# Altium schematic sheet TLC6C598_Q1.SchDoc
size 431 x 279 mm; Date: Not shown in title block; ApprovedBy: Not shown in title block; CheckedBy: Not shown in title block; Author: Not shown in title block; CompanyName: Not shown in title block; DrawnBy: Andy Lin (TI); Engineer: Not shown in title block; Organization: Not shown in title block; Address1: Not shown in title block; Address2: Not shown in title block; Address3: Not shown in title block; Address4: Not shown in title block; DocumentNumber: 11; Revision: Use project parameter SCH_Rev; SheetNumber: 11; SheetTotal: 14; PageSetup: Record=PageOptions|CenterHorizontal=True|CenterVertical=True|PrintScale=1.00|XCorrection=1.00|YCorrection=1.00|PrintKind=0|BorderSize=5000000|LeftOffset=0|BottomOffset=0|Orientation=2|PaperLength=1000|PaperWidth=1000|Scale=100|PaperSource=15|PrintQuality=600|MediaType=1|DitherType=10|PaperKind=Letter|PrintScaleMode=1; CurrentTime: Not shown in title block; CurrentDate: Not shown in title block; Time: Not shown in title block; DocumentFullPathAndName: Not shown in title block; DocumentName: Not shown in title block; ModifiedDate: Not shown in title block; ImagePath: Not shown in title block
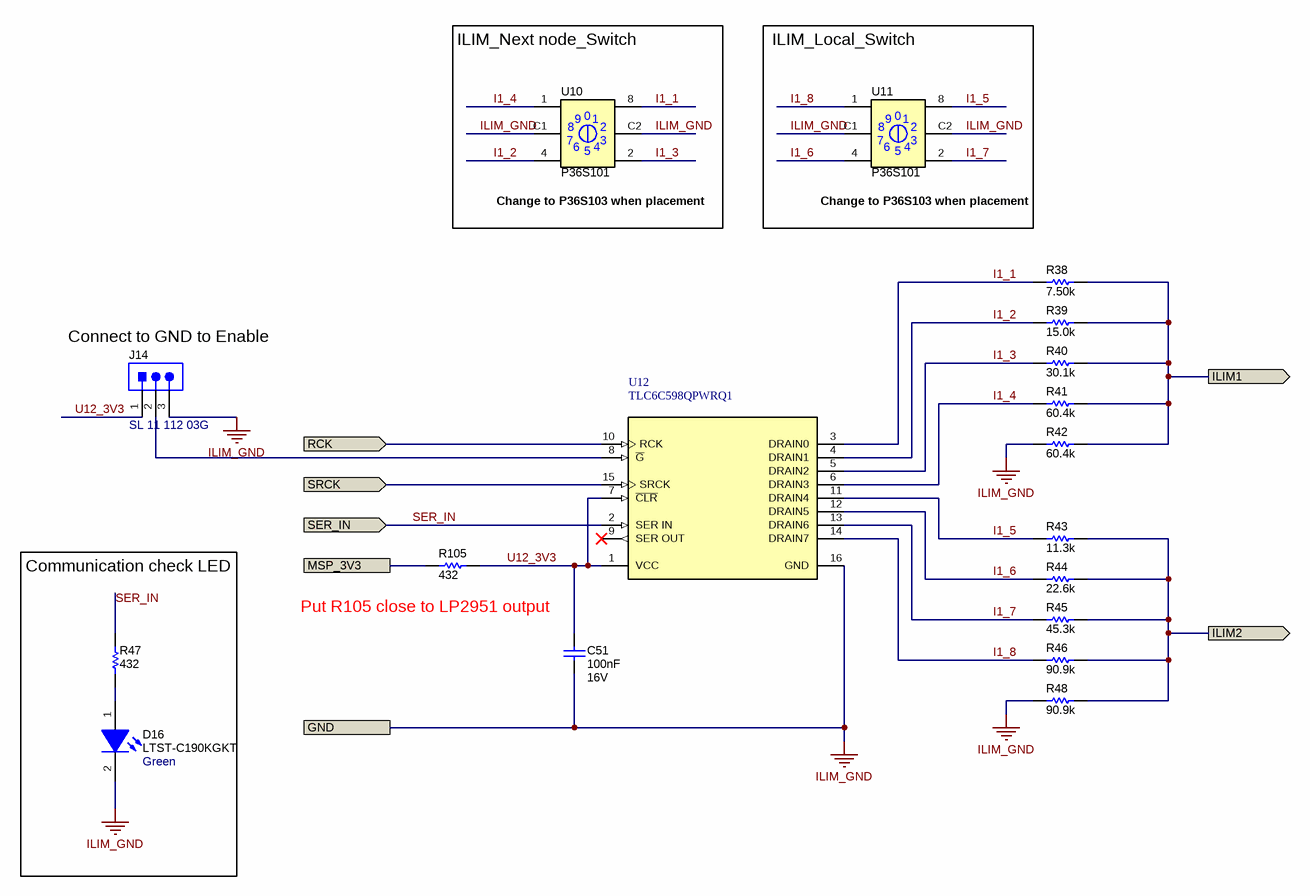
[diagram p0: TLC6C598_Q1.SchDoc]

## Parts
C51  Cap_F: 100nF  VDC_V: 16V  [0603]  (hidden comment: GRM188R71C104KA01D)
D16  LTST-C190KGKT  value Green  [LED_LTST-C190_G]
J14  SL 11 112 03G  [Fischer_SL-11-112-03G]
R38  ValueDisplayed: 7.50k  [0402]  (hidden comment: CRCW04027K50FKED)
R39  ValueDisplayed: 15.0k  [0402]  (hidden comment: CRCW040215K0FKED)
R40  ValueDisplayed: 30.1k  [0402]  (hidden comment: CRCW040230K1FKED)
R41  ValueDisplayed: 60.4k  [0402]  (hidden comment: CRCW040260K4FKED)
R42  ValueDisplayed: 60.4k  [0402]  (hidden comment: CRCW040260K4FKED)
R43  ValueDisplayed: 11.3k  [0402]  (hidden comment: CRCW040211K3FKED)
R44  ValueDisplayed: 22.6k  [0402]  (hidden comment: CRCW040222K6FKED)
R45  ValueDisplayed: 45.3k  [0402]  (hidden comment: CRCW040245K3FKED)
R46  ValueDisplayed: 90.9k  [0402]  (hidden comment: CRCW040290K9FKED)
R47  ValueDisplayed: 432  [0603]  (hidden comment: CRCW0603432RFKEA)
R48  ValueDisplayed: 90.9k  [0402]  (hidden comment: CRCW040290K9FKED)
R105  ValueDisplayed: 432  [0603]  (hidden comment: CRCW0603432RFKEA)
U10  P36S101  [Apem_P36S10x]
U11  P36S101  [Apem_P36S10x]
U12  TLC6C598QPWRQ1  [PW0016A_N]

## Blocks framed on the sheet
ILIM_Next node_Switch: U10
ILIM_Local_Switch: U11
Communication check LED: D16 R47

## Ports
GND, ILIM1 (out), ILIM2 (out), MSP_3V3, RCK (in), SER_IN (in), SRCK (in)

## Nets
ILIM_GND: C51.2 D16.2(K) J14.3 R42.1 R48.1 U10.C1 U10.C2 U11.C1 U11.C2 U12.16(GND) ; port GND
I1_1: R38.1 U10.8 U12.3(DRAIN0)
I1_2: R39.1 U10.4 U12.4(DRAIN1)
I1_3: R40.1 U10.2 U12.5(DRAIN2)
I1_4: R41.1 U10.1 U12.6(DRAIN3)
I1_5: R43.1 U11.8 U12.11(DRAIN4)
I1_6: R44.1 U11.4 U12.12(DRAIN5)
I1_7: R45.1 U11.2 U12.13(DRAIN6)
I1_8: R46.1 U11.1 U12.14(DRAIN7)
ILIM1: R38.2 R39.2 R40.2 R41.2 R42.2 ; port ILIM1
ILIM2: R43.2 R44.2 R45.2 R46.2 R48.2 ; port ILIM2
MSP_3V3: R105.2 ; port MSP_3V3
RCK: U12.10(RCK) ; port RCK
SER_IN: R47.2 U12.2(SER_IN) ; port SER_IN
SRCK: U12.15(SRCK) ; port SRCK
U12_3V3: C51.1 J14.1 R105.1 U12.1(VCC) U12.7(~{CLR})
NetD16_1: D16.1(A) R47.1
NetJ14_2: J14.2 U12.8(~{G})

Not connected (* = marked no-connect by the designer): U12 9(SER_OUT)*

## Notes on the sheet
- (near U10) Change to P36S103 when placement
- (near U11) Change to P36S103 when placement
- (near J14) Connect to GND to Enable
- Put R105 close to LP2951 output
- Drawn By:
- SVN Rev:
- Number:
- TID #:
- Orderable:
- Rev:
- Sheet Title:
- File:
- Project Title:
- Designed for:
- Assembly Variant:
- Mod. Date:
- Sheet:
- Size:
- of
- B
- http://www.ti.com
- Texas Instruments and/or its licensors do not warrant the accuracy or completeness of this specification or any information contained therein. Texas Instruments and/or its licensors do not warrant that this design will meet the specifications, will be suitable for your application or fit for any particular purpose, or will operate in an implementation. Texas Instruments and/or its licensors do not warrant that the design is production worthy. You should completely validate and test your design implementation to confirm the system functionality for your application.
- Engineer:
- Contact:
- © Texas Instruments
- (in symbol CMP-0002168-2) 0; 9; 7; 3; 6; 5

## Library data of the parts
C51 = CMP-0007378-4: CAP, CERM, 0.1 uF, 16 V, +/- 10%, X7R, 0603; Manufacturer: MuRata; TaMin_C: -55°C; Polarized: N; SizeAreaWB_mm2: 4.68; Value1: Unknown; U/M: EA; Value: 0.1uF; TaMax_C: 125°C; SizeZ_mm: 1; SizeX_mm: 1.6; SizeY_mm: 0.8; SizeArea_mm2: 1.28; AEC Category: Q200; Supplier Part Number 2: 81-GRM39X104K16; Publisher: Texas Instruments; Supplier 2: Mouser; Supplier Part Number 3: 1828890; TempCo: X7R; Supplier 3: Farnell; Published: 2008-06-19; RoHS: Y; MountType: SMT; Supplier 1: Digi-Key; PackageReference: 0603; Tolerance_%: 10%; Cap_Case: 0603; Value2: 16V; CompType: Capacitor; LatestRevisionDate: 2017-03-09; PartNumber: GRM188R71C104KA01D; AEC Qualified: ?; ComponentLink1Description: Datasheet link; Supplier Part Number 1: 490-1532-1-ND; Technology: Ceramic; ValueDisplayed: 0.1uF; ComponentLink1URL: http://search.murata.co.jp/Ceramy/PnsearchViewAction.do?HnOFG=ON&HnNFG=ON&SEL_CNT=50&sLang=en&sKey=GRM188R71C104KA01D&x=9&y=9&search=startwith
D16 = CMP-0002840-2: LED, Green, SMD; Manufacturer: Lite-On; Value1: W; Io_A: 30mA; Value2: 2V; Tjmax_C: 85°C; Type: AlInGaP; PartNumber: LTST-C190KGKT; MountType: SMT; CompType: LED; Color: green; ComponentLink1Description: Datasheet link; RoHS: Y; ComponentLink1URL: http://optoelectronics.liteon.com/en-us/api/DwonloadFileHandler.ashx?txtSpecNo=DS22-2000-074&txtPartNo=LTST-C190KGKT; Vf_V: 2V; PackageReference: 1.6x0.8x0.8mm
J14 = CMP-0075048-1: Header, 2.54mm, 3x1, Gold, TH; Manufacturer: Fischer Elektronik; CT: False; CNHeader: True; ComponentLink1URL: http://www.fischerelektronik.de/web_fischer/public/index.xhtml; Publisher: Texas Instruments; CompType: Header; PackageReference: TH, 3-Leads, Body 2.5x7.62mm, Pitch 2.54mm; LatestRevisionDate: 2017-07-12; ClassName: Header; MountType: TH; PartNumber: SL 11 112 03G; ComponentLink1Description: Datasheet URL
R38 = CMP-0026555-2: RES, 7.50 k, 1%, 0.063 W, AEC-Q200 Grade 0, 0402; Manufacturer: Vishay-Dale; Power_W: 63mW; TempCo: 100 ppm/C; Value_Code: 7k50; Value: 7.50k; EIA_Code: E96; Res_ohm: 7.5k; SizeX_mm: 1; SizeY_mm: 0.5; SizeZ_mm: 0.6; Value2: 0.063W; AEC Qualified: Y; VDC_V: 50V; AEC Category: Q200; AEC Grade: 0; ComponentLink1URL: http://www.vishay.com/docs/20035/dcrcwe3.pdf; Supplier Part Number 2: 52K7245; Supplier 2: Newark; Supplier Part Number 3: 71-CRCW0402-7.5K-E3; Supplier 3: Mouser; RoHS: E; Value1: 1%; MountType: SMT; Supplier 1: Digi-Key; PackageReference: 0402; Tolerance_%: 1%; SizeArea_mm2: 0.5; CompType: Resistor; PartNumber: CRCW04027K50FKED; ComponentLink1Description: Datasheet link; Supplier Part Number 1: 541-7.50KLCT-ND; Technology: Thick Film
R39 = CMP-0026027-3: RES, 15.0 k, 1%, 0.063 W, AEC-Q200 Grade 0, 0402; Manufacturer: Vishay-Dale; Power_W: 63mW; TempCo: 100 ppm/C; Value_Code: 15k0; Value: 15.0k; EIA_Code: E96; Res_ohm: 15k; SizeX_mm: 1; SizeY_mm: 0.5; SizeZ_mm: 0.6; Value2: 0.063W; AEC Qualified: Y; VDC_V: 50V; AEC Category: Q200; AEC Grade: 0; Supplier Part Number 2: 52K6708; Supplier 2: Newark; Supplier Part Number 3: 71-CRCW0402-15K-E3; Supplier 3: Mouser; RoHS: E; Value1: 1%; MountType: SMT; Supplier 1: Digi-Key; PackageReference: 0402; Tolerance_%: 1%; SizeArea_mm2: 0.5; CompType: Resistor; PartNumber: CRCW040215K0FKED; ComponentLink1Description: Datasheet link; Supplier Part Number 1: 541-15.0KLCT-ND; Technology: Thick Film; ComponentLink1URL: http://www.vishay.com/docs/20035/dcrcwe3.pdf
R40 = CMP-0026284-2: RES, 30.1 k, 1%, 0.063 W, AEC-Q200 Grade 0, 0402; Manufacturer: Vishay-Dale; Power_W: 63mW; TempCo: 100 ppm/C; Value_Code: 30k1; Value: 30.1k; EIA_Code: E96; SizeX_mm: 1; SizeY_mm: 0.5; SizeZ_mm: 0.6; Value2: 0.063W; AEC Qualified: Y; VDC_V: 50V; AEC Category: Q200; AEC Grade: 0; ComponentLink1URL: http://www.vishay.com/docs/20035/dcrcwe3.pdf; Supplier Part Number 2: 52K6954; Supplier 2: Newark; Supplier Part Number 3: 71-CRCW0402-30.1K-E3; Supplier 3: Mouser; RoHS: E; Value1: 1%; MountType: SMT; Supplier 1: Digi-Key; PackageReference: 0402; Tolerance_%: 1%; Res_ohm: 30.1k; SizeArea_mm2: 0.5; CompType: Resistor; PartNumber: CRCW040230K1FKED; ComponentLink1Description: Datasheet link; Supplier Part Number 1: 541-30.1KLCT-ND; Technology: Thick Film
R41 R42 = CMP-0026486-2: RES, 60.4 k, 1%, 0.063 W, AEC-Q200 Grade 0, 0402; Manufacturer: Vishay-Dale; Power_W: 63mW; TempCo: 100 ppm/C; Value_Code: 60k4; Value: 60.4k; EIA_Code: E96; SizeX_mm: 1; SizeY_mm: 0.5; SizeZ_mm: 0.6; Value2: 0.063W; AEC Qualified: Y; VDC_V: 50V; AEC Category: Q200; AEC Grade: 0; ComponentLink1URL: http://www.vishay.com/docs/20035/dcrcwe3.pdf; Supplier Part Number 2: 52K7190; Supplier 2: Newark; Supplier Part Number 3: 71-CRCW0402-60.4K-E3; Supplier 3: Mouser; RoHS: E; Value1: 1%; MountType: SMT; Supplier 1: Digi-Key; PackageReference: 0402; Tolerance_%: 1%; Res_ohm: 60.4k; SizeArea_mm2: 0.5; CompType: Resistor; PartNumber: CRCW040260K4FKED; ComponentLink1Description: Datasheet link; Supplier Part Number 1: 541-60.4KLCT-ND; Technology: Thick Film
R43 = CMP-0025976-3: RES, 11.3 k, 1%, 0.063 W, AEC-Q200 Grade 0, 0402; Manufacturer: Vishay-Dale; Power_W: 63mW; TempCo: 100 ppm/C; Value_Code: 11k3; Value: 11.3k; EIA_Code: E96; SizeX_mm: 1; SizeY_mm: 0.5; SizeZ_mm: 0.6; Value2: 0.063W; AEC Qualified: Y; VDC_V: 50V; AEC Category: Q200; AEC Grade: 0; Supplier Part Number 2: 52K6622; Supplier 2: Newark; Supplier Part Number 3: 71-CRCW0402-11.3K-E3; Supplier 3: Mouser; RoHS: E; Value1: 1%; MountType: SMT; Supplier 1: Digi-Key; PackageReference: 0402; Tolerance_%: 1%; Res_ohm: 11.3k; SizeArea_mm2: 0.5; CompType: Resistor; PartNumber: CRCW040211K3FKED; ComponentLink1Description: Datasheet link; Supplier Part Number 1: 541-11.3KLCT-ND; Technology: Thick Film; ComponentLink1URL: http://www.vishay.com/docs/20035/dcrcwe3.pdf
R44 = CMP-0026179-2: RES, 22.6 k, 1%, 0.063 W, AEC-Q200 Grade 0, 0402; Manufacturer: Vishay-Dale; Power_W: 63mW; TempCo: 100 ppm/C; Value_Code: 22k6; Value: 22.6k; EIA_Code: E96; SizeX_mm: 1; SizeY_mm: 0.5; SizeZ_mm: 0.6; Value2: 0.063W; AEC Qualified: Y; VDC_V: 50V; AEC Category: Q200; AEC Grade: 0; ComponentLink1URL: http://www.vishay.com/docs/20035/dcrcwe3.pdf; Supplier Part Number 2: 52K6845; Supplier 2: Newark; Supplier Part Number 3: 71-CRCW0402-22.6K-E3; Supplier 3: Mouser; RoHS: E; Value1: 1%; MountType: SMT; Supplier 1: Digi-Key; PackageReference: 0402; Tolerance_%: 1%; Res_ohm: 22.6k; SizeArea_mm2: 0.5; CompType: Resistor; PartNumber: CRCW040222K6FKED; ComponentLink1Description: Datasheet link; Supplier Part Number 1: 541-22.6KLCT-ND; Technology: Thick Film
R45 = CMP-0026387-2: RES, 45.3 k, 1%, 0.063 W, AEC-Q200 Grade 0, 0402; Manufacturer: Vishay-Dale; Power_W: 63mW; TempCo: 100 ppm/C; Value_Code: 45k3; Value: 45.3k; EIA_Code: E96; SizeX_mm: 1; SizeY_mm: 0.5; SizeZ_mm: 0.6; Value2: 0.063W; AEC Qualified: Y; VDC_V: 50V; AEC Category: Q200; AEC Grade: 0; ComponentLink1URL: http://www.vishay.com/docs/20035/dcrcwe3.pdf; Supplier Part Number 2: 52K7083; Supplier 2: Newark; Supplier Part Number 3: 71-CRCW0402-45.3K-E3; Supplier 3: Mouser; RoHS: E; Value1: 1%; MountType: SMT; Supplier 1: Digi-Key; PackageReference: 0402; Tolerance_%: 1%; Res_ohm: 45.3k; SizeArea_mm2: 0.5; CompType: Resistor; PartNumber: CRCW040245K3FKED; ComponentLink1Description: Datasheet link; Supplier Part Number 1: 541-45.3KLCT-ND; Technology: Thick Film
R46 R48 = CMP-0026605-2: RES, 90.9 k, 1%, 0.063 W, AEC-Q200 Grade 0, 0402; Manufacturer: Vishay-Dale; Power_W: 63mW; TempCo: 100 ppm/C; Value_Code: 90k9; Value: 90.9k; EIA_Code: E96; SizeX_mm: 1; SizeY_mm: 0.5; SizeZ_mm: 0.6; Value2: 0.063W; AEC Qualified: Y; VDC_V: 50V; AEC Category: Q200; AEC Grade: 0; ComponentLink1URL: http://www.vishay.com/docs/20035/dcrcwe3.pdf; Supplier Part Number 2: 52K7338; Supplier 2: Newark; Supplier Part Number 3: 71-CRCW0402-90.9K-E3; Supplier 3: Mouser; RoHS: E; Value1: 1%; MountType: SMT; Supplier 1: Digi-Key; PackageReference: 0402; Tolerance_%: 1%; Res_ohm: 90.9k; SizeArea_mm2: 0.5; CompType: Resistor; PartNumber: CRCW040290K9FKED; ComponentLink1Description: Datasheet link; Supplier Part Number 1: 541-90.9KLCT-ND; Technology: Thick Film
R47 R105 = CMP-0022421-5: RES, 432, 1%, 0.1 W, AEC-Q200 Grade 0, 0603; Manufacturer: Vishay-Dale; Power_W: 100mW; TempCo: 100 ppm/C; Value_Code: 432R; Value: 432; EIA_Code: E96; SizeX_mm: 1.6; SizeY_mm: 0.8; SizeZ_mm: 1; Value2: 0.1W; SizeArea_mm2: 1.28; AEC Qualified: Y; VDC_V: 75V; AEC Category: Q200; AEC Grade: 0; Supplier Part Number 2: 52K8531; Supplier 2: Newark; Supplier Part Number 3: 71-CRCW0603-432-E3; Supplier 3: Mouser; RoHS: E; Value1: 1%; MountType: SMT; Supplier 1: Digi-Key; PackageReference: 0603; Tolerance_%: 1%; Res_ohm: 432; CompType: Resistor; PartNumber: CRCW0603432RFKEA; ComponentLink1Description: Datasheet link; Supplier Part Number 1: 541-432HCT-ND; Technology: Thick Film; ComponentLink1URL: http://www.vishay.com/docs/20035/dcrcwe3.pdf
U10 U11 = CMP-0002168-2: Switch, Rotary dip, 10POS, BCD, 24V, SMT; Manufacturer: APEM; CurrentRating_mA: 100A; PositionCount: 10; Supplier 2: Newark; Supplier 3: Mouser; Supplier 1: Digi-Key; Supplier Part Number 1: 679-1953-ND; Supplier Part Number 2: 92K8405; Supplier Part Number 3: 642-P36S101; PartNumber: P36S101; ComponentLink1Description: Datasheet URL; LatestRevisionDate: 2017-03-09; CompType: Switch; PackageReference: Switch, 7.4x3.8x7.4mm; Publisher: Texas Instruments; Circuit: BCD; VDC_V: 24V; RoHS: Y; Orientation: Top Actuated; MountType: SMT; ComponentLink1URL: http://www.apem.com/files/apem/brochures/P36.pdf
U12 = CMP-0044767-1: Automotive Power Logic 8-Bit Shift Register LED Driver, PW0016A, LARGE T&R; Generic Part Number: TLC6C598-Q1; Manufacturer: Texas Instruments; rDS(on)(Ohms): 7.4; IO(CONT)(A): 0.05; VDS(Max)(V): 40; ICC(uA): 88; tPLH(ns): 218; Rating: Automotive; PackageReference: PW0016A; DatasheetVersion: SLIS142B; Operating Temperature Range(C): -40 to 125